# Altium schematic sheet Out2.SchDoc
size A; SheetNumber: 5; SheetTotal: 6
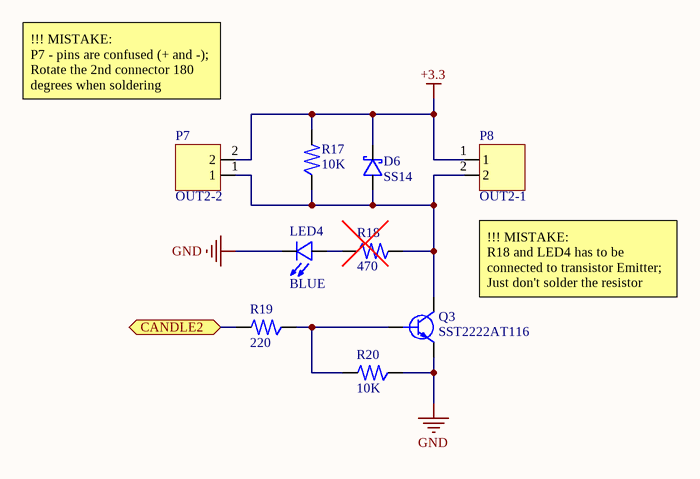
[diagram p0: Out2.SchDoc]

## Parts
D6  SS14  [SMT_DIODE_SCHTKY_VISHAI]
LED4  BLUE  [SMT_LED_0805(2012)_WURTH]
P7  OUT2-2  [THT_CON_WAFER_2P_NEL_2217S-02-WH2]
P8  OUT2-1  [THT_CON_WAFER_2P_NEL_2217S-02-WH2]
Q3  SST2222AT116  [SMT_TRANS_SST2222AT116_SOT23]
R17  10K  [SMT_RES_0805(2012)]
R18  470  [SMT_RES_0805(2012)]
R19  220  [SMT_RES_0805(2012)]
R20  10K  [SMT_RES_0805(2012)]

## Ports
CANDLE2 (bidir)

## Nets
+3.3: D6.2 P7.2 P8.1 R17.1
GND: LED4.1 Q3.1(E) R20.2
CANDLE2: R19.1 ; port CANDLE2
NetD6_1: D6.1 P7.1 P8.2 Q3.3(C) R17.2 R18.1
NetLED4_2: LED4.2 R18.2
NetQ3_2: Q3.2(B) R19.2 R20.1

## Notes on the sheet
- !!! MISTAKE:
  P7 - pins are confused (+ and -);
  Rotate the 2nd connector 180 degrees when soldering
- !!! MISTAKE:
  R18 and LED4 has to be connected to transistor Emitter;
  Just don't solder the resistor

## Library data of the parts
D6 = SMT_DIODE_SCHTKY_VISHAI: SMT Diode Schottky Vishay DO-214AC SS14-M3/5AT IF=1A VR=40 V FV=0.5VG
LED4 = SMT_LED_0805(2012)_WURTH: LED 0805(2012) 20mA 2V 150080YS75000 by Wurth Elektronik
P7 P8 = THT_CON_WAFER_2P_NEL_2217S-02-WH2: Connector Wafer NELTRON 2-Pins Pitch-2.54mm 250V/3A 2217S-02-WH2
Q3 = SMT_TRANS_SST2222AT116_SOT23: Transistor NPN SST2222AT116 SOT23 700mA 40V
R17-R20 = SMT_RES_0805(2012): 0805(2012) Resistor 1/4-1/8W 150V 2A